# EAGLE design switchesbrd (EAGLE 9.4.2)
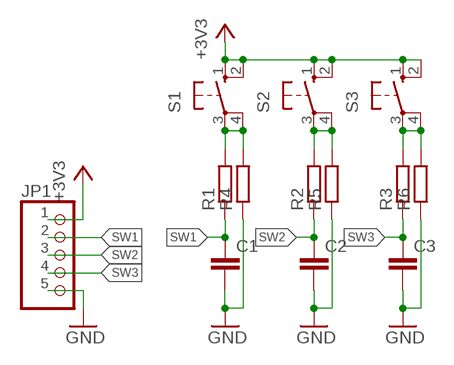
[diagram p0: schematic, sheet 1]

## Parts
C1  C-EU025-025X050  [C025-025X050]
C2  C-EU025-025X050  [C025-025X050]
C3  C-EU025-025X050  [C025-025X050]
JP1  PINHD-1X5  [1X05]
R1  R-EU_0204/5  [0204/5]
R2  R-EU_0204/5  [0204/5]
R3  R-EU_0204/5  [0204/5]
R4  R-EU_0204/5  [0204/5]
R5  R-EU_0204/5  [0204/5]
R6  R-EU_0204/5  [0204/5]
S1  10-XX  [B3F-10XX]
S2  10-XX  [B3F-10XX]
S3  10-XX  [B3F-10XX]

## Nets
+3V3: JP1.1 S1.1(S) S1.2(S1) S2.1(S) S2.2(S1) S3.1(S) S3.2(S1)
GND: C1.2 C2.2 C3.2 JP1.5 R4.1 R5.1 R6.1
N$2: R1.2 R4.2 S1.3(P) S1.4(P1)
N$3: R2.2 R5.2 S2.3(P) S2.4(P1)
N$4: R3.2 R6.2 S3.3(P) S3.4(P1)
SW1: C1.1 JP1.2 R1.1
SW2: C2.1 JP1.3 R2.1
SW3: C3.1 JP1.4 R3.1

## Library data of the parts
C1-C3 = rcl:C-EU: CAPACITOR, European symbol; SPICEPREFIX: C
JP1 = pinhead:PINHD-1X5: PIN HEADER
R1-R6 = rcl:R-EU_: RESISTOR, European symbol; SPICEPREFIX: R
S1-S3 = switch-omron:10-XX: OMRON SWITCH; MPN: B3F-1000; OC_FARNELL: 176432; OC_NEWARK: 36M3542

## Board
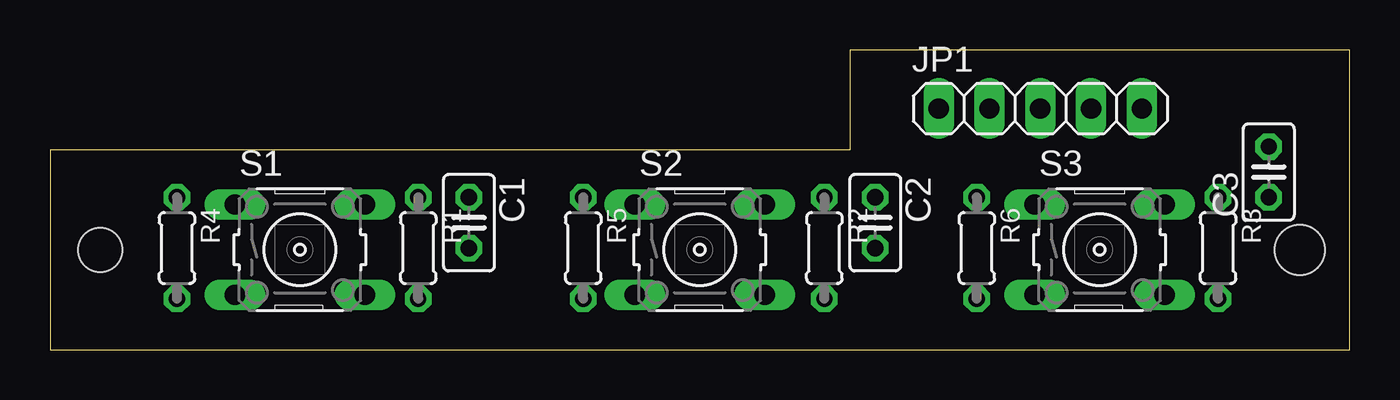
[diagram p1: board, top side]
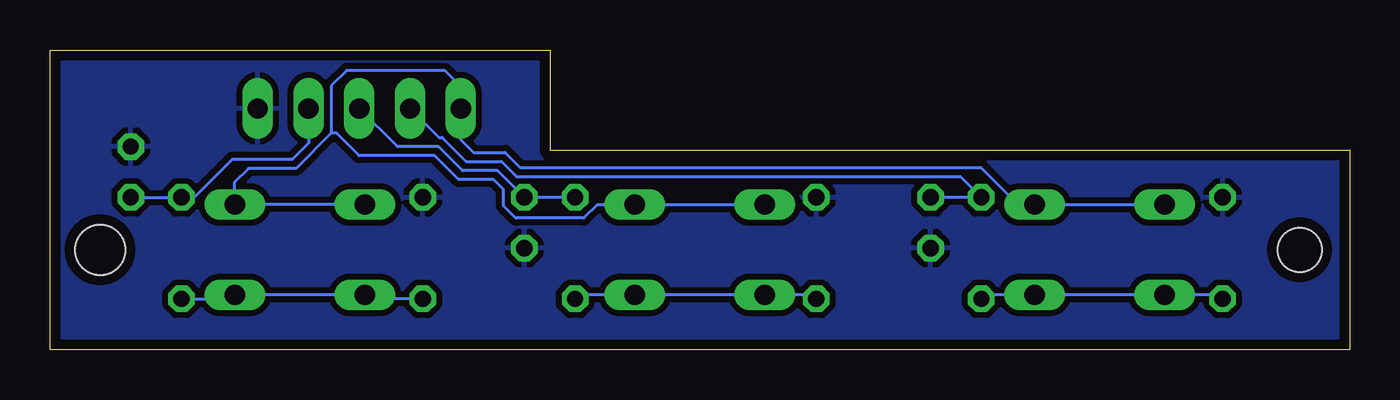
[diagram p2: board, bottom side, seen from below]

Size 65 x 15 mm. Coordinates in mm from the lower left corner, seen from the top.
Outline: 0,0 65,0 65,15 40,15 40,10 0,10 0,0
Copper layers (1*16): Top 0.035mm / dielectric 1.5mm / Bottom 0.035mm
Design rules "default *": minimum track width 6mil, minimum drill 0.35mm, track to track 12mil, track to pad 12mil, pad to pad 12mil, via to via 12mil, smd to smd 12mil, copper to edge 20mil, drill to drill 6mil, minimum pad ring 10mil, minimum via ring 8mil, stop-mask expansion 4mil, vias tented up to drill 0mil, thermal gap 12mil
Holes 2.2 mm at 2.5,5
Holes 2.5 mm at 62.5,5

### Footprints (pad centres in the part's own frame; a part is rotated, then mirrored left to right if it is on the bottom)
C025-025X050 = drill 0.813 octagon: 1 -1.27,0; 2 1.27,0
1X05 = drill 1.016 long: 1 -5.08,0; 2 -2.54,0; 3 0,0; 4 2.54,0; 5 5.08,0
0204/5 = drill 0.813 octagon: 1 -2.54,0; 2 2.54,0
B3F-10XX = drill 1.016 long: 1 -3.251,2.261; 2 3.251,2.261; 3 -3.251,-2.261; 4 3.251,-2.261

### Placement (x,y rotation side)
C1  20.95,6.35 270 top
C2  41.27,6.35 270 top
C3  60.96,8.89 90 top
JP1  49.53,12.06 0 top
R1  18.41,5.08 270 top
R2  38.73,5.08 270 top
R3  58.42,5.08 270 top
R4  6.35,5.08 270 top
R5  26.67,5.08 270 top
R6  46.35,5.08 270 top
S1  12.5,5 0 top
S2  32.5,5 0 top
S3  52.5,5 0 top

### Tracks (layer width: path | path; a pad name or v marks a point on that pad's centre or on a via)
+3V3
  Bottom 0.152: S3.1 S3.2 55.75,8.38 55.07,9.07 52.69,9.07 50.93,10.83 | 50.93,10.83 50.93,13.21 50.16,13.97 45.25,13.97 44.45,13.17 JP1.1 44.45,10.51 43.81,9.87 42.23,9.87 41.48,9.12 18.44,9.12 16.58,7.26 S1.2 S1.1 | 27.78,7.26 S2.1 S2.2 37.62,7.26 38.3,6.58 41.71,6.58 42.32,7.19 42.32,8.02 42.8,8.5 44.56,8.5 45.76,9.7 49.55,9.7 50.67,10.83 50.93,10.83
GND
  pour Bottom: 0,0 0,15.24 65.41,15.24 65.41,0
N$2
  Bottom 0.152: R4.2 6.55,2.74 S1.3 S1.4 18.22,2.74 R1.2
N$3
  Bottom 0.152: R5.2 26.87,2.74 S2.3 S2.4 38.54,2.74 R2.2
N$4
  Bottom 0.152: R3.2 55.95,2.54 S3.4 49.53,2.74 | S3.3 49.53,2.74 | R6.2 49.33,2.54 49.53,2.74
SW1
  Bottom 0.152: 46.83,12.06 JP1.2 45.54,10.62 45.38,10.62 44.18,9.42 42.42,9.42 41.67,8.66 19.46,8.66 R1.1 C1.1
SW2
  Bottom 0.152: R2.1 C2.1 42.61,8.96 44.37,8.96 45.57,10.16 47.62,10.16 JP1.3
SW3
  Bottom 0.152: C3.1 R3.1 57.8,7.62 55.89,9.53 52.88,9.53 52.07,10.33 JP1.4